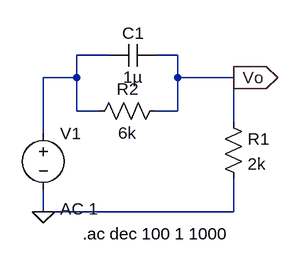
[diagram p0: schematic passive-filter-high-pass.asc]
passive-filter-high-pass.asc, the LTspice schematic file:
Version 4
SHEET 1 880 680
WIRE 112 48 64 48
WIRE 208 48 176 48
WIRE 64 80 64 48
WIRE 64 80 16 80
WIRE 208 80 208 48
WIRE 288 80 208 80
WIRE 64 128 64 80
WIRE 96 128 64 128
WIRE 208 128 208 80
WIRE 208 128 176 128
WIRE 288 144 288 80
WIRE 16 160 16 80
WIRE 16 272 16 240
WIRE 288 272 288 224
WIRE 288 272 16 272
FLAG 16 272 0
FLAG 288 80 Vo
IOPIN 288 80 Out
SYMBOL res 272 128 R0
SYMATTR InstName R1
SYMATTR Value 2k
SYMBOL res 80 144 R270
WINDOW 0 32 56 VTop 2
WINDOW 3 0 56 VBottom 2
SYMATTR InstName R2
SYMATTR Value 6k
SYMBOL cap 112 64 R270
WINDOW 0 32 32 VTop 2
WINDOW 3 0 32 VBottom 2
SYMATTR InstName C1
SYMATTR Value 1µ
SYMBOL voltage 16 144 R0
WINDOW 123 24 124 Left 2
WINDOW 39 0 0 Left 2
SYMATTR Value2 AC 1
SYMATTR InstName V1
SYMATTR Value ""
TEXT 72 304 Left 2 !.ac dec 100 1 1000

The netlist it stands for:
* passive-filter-high-pass.asc
R1 Vo 0 2k
R2 N001 Vo 6k
C1 N001 Vo 1µ
V1 N001 0 AC 1
.ac dec 100 1 1000
.backanno
.end